# EAGLE design daq_extention_board (EAGLE 7.1.0)
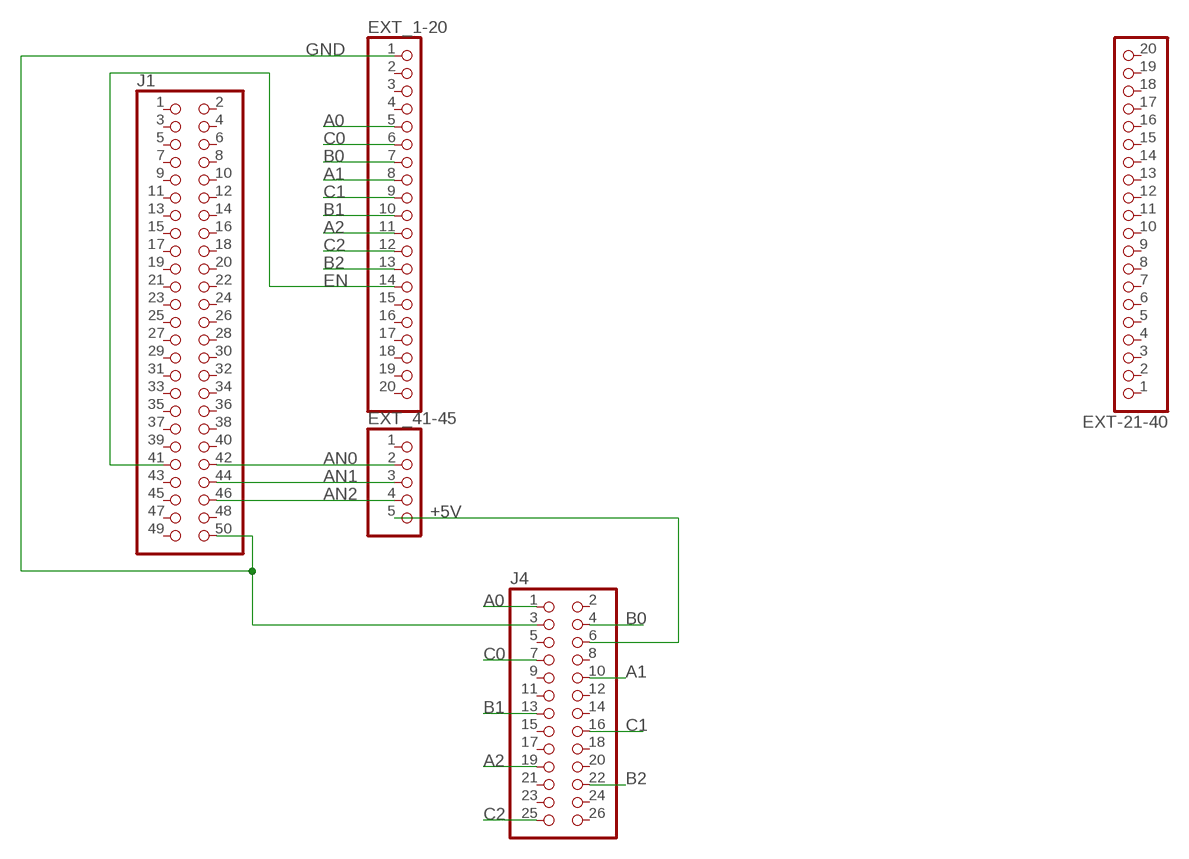
[diagram p0: schematic, sheet 1]

## Parts
EXT-21-40  PINHD-1X20  [1X20]
EXT_1-20  PINHD-1X20  [1X20]
EXT_41-45  PINHD-1X5  [1X05]
J1  PINHD-2X25  [2X25]
J4  PINHD-2X13  [2X13]

## Nets
+5V: EXT_41-45.5 J4.6
A0: EXT_1-20.5 J4.1
A1: EXT_1-20.8 J4.10
A2: EXT_1-20.11 J4.19
AN0: EXT_41-45.2 J1.42
AN1: EXT_41-45.3 J1.44
AN2: EXT_41-45.4 J1.46
B0: EXT_1-20.7 J4.4
B1: EXT_1-20.10 J4.13
B2: EXT_1-20.13 J4.22
C0: EXT_1-20.6 J4.7
C1: EXT_1-20.9 J4.16
C2: EXT_1-20.12 J4.25
EN: EXT_1-20.14 J1.41
GND: EXT_1-20.1 J1.50 J4.3
Unconnected: EXT-21-40.1 EXT-21-40.2 EXT-21-40.3 EXT-21-40.4 EXT-21-40.5 EXT-21-40.6 EXT-21-40.7 EXT-21-40.8 EXT-21-40.9 EXT-21-40.10 EXT-21-40.11 EXT-21-40.12 EXT-21-40.13 EXT-21-40.14 EXT-21-40.15 EXT-21-40.16 EXT-21-40.17 EXT-21-40.18 EXT-21-40.19 EXT-21-40.20 EXT_1-20.2 EXT_1-20.3 EXT_1-20.4 EXT_1-20.15 EXT_1-20.16 EXT_1-20.17 EXT_1-20.18 EXT_1-20.19 EXT_1-20.20 EXT_41-45.1 J1.1 J1.2 J1.3 J1.4 J1.5 J1.6 J1.7 J1.8 J1.9 J1.10 J1.11 J1.12 J1.13 J1.14 J1.15 J1.16 J1.17 J1.18 J1.19 J1.20 J1.21 J1.22 J1.23 J1.24 J1.25 J1.26 J1.27 J1.28 J1.29 J1.30 J1.31 J1.32 J1.33 J1.34 J1.35 J1.36 J1.37 J1.38 J1.39 J1.40 J1.43 J1.45 J1.47 J1.48 J1.49 J4.2 J4.5 J4.8 J4.9 J4.11 J4.12 J4.14 J4.15 J4.17 J4.18 J4.20 J4.21 J4.23 J4.24 J4.26

## Library data of the parts
EXT-21-40 EXT_1-20 = pinhead:PINHD-1X20: PIN HEADER
EXT_41-45 = pinhead:PINHD-1X5: PIN HEADER
J1 = pinhead:PINHD-2X25: PIN HEADER
J4 = pinhead:PINHD-2X13: PIN HEADER

## Board
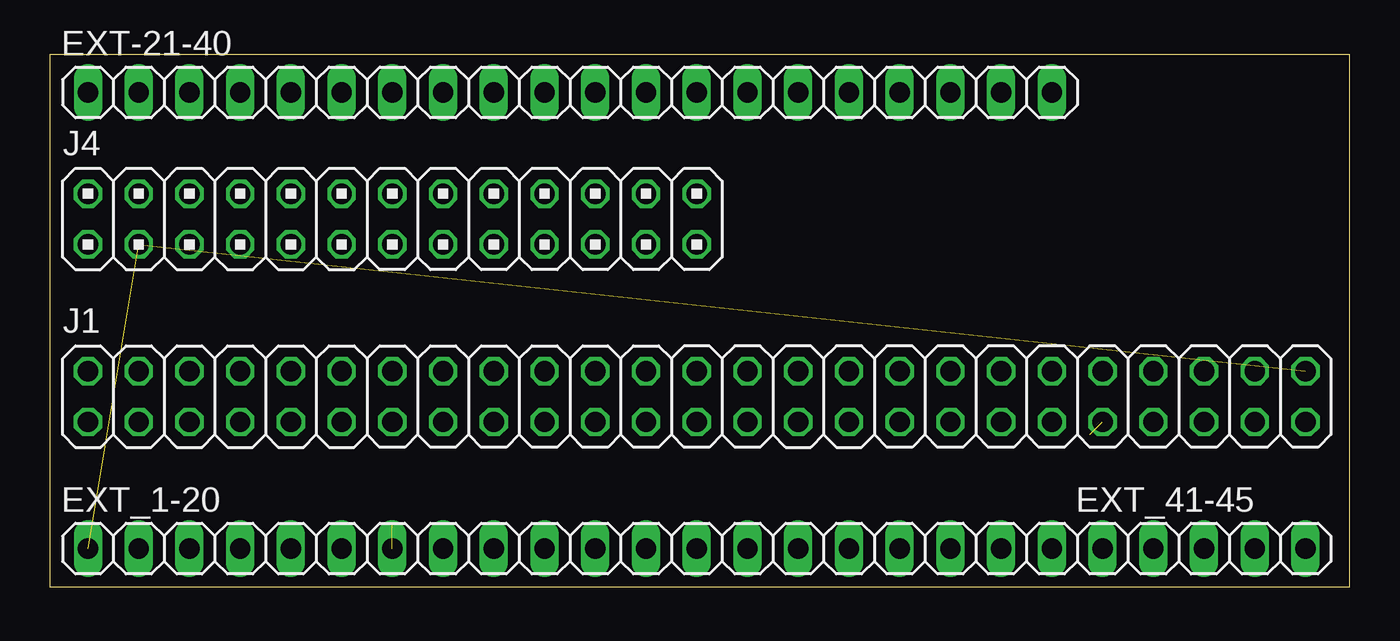
[diagram p1: board, top side]
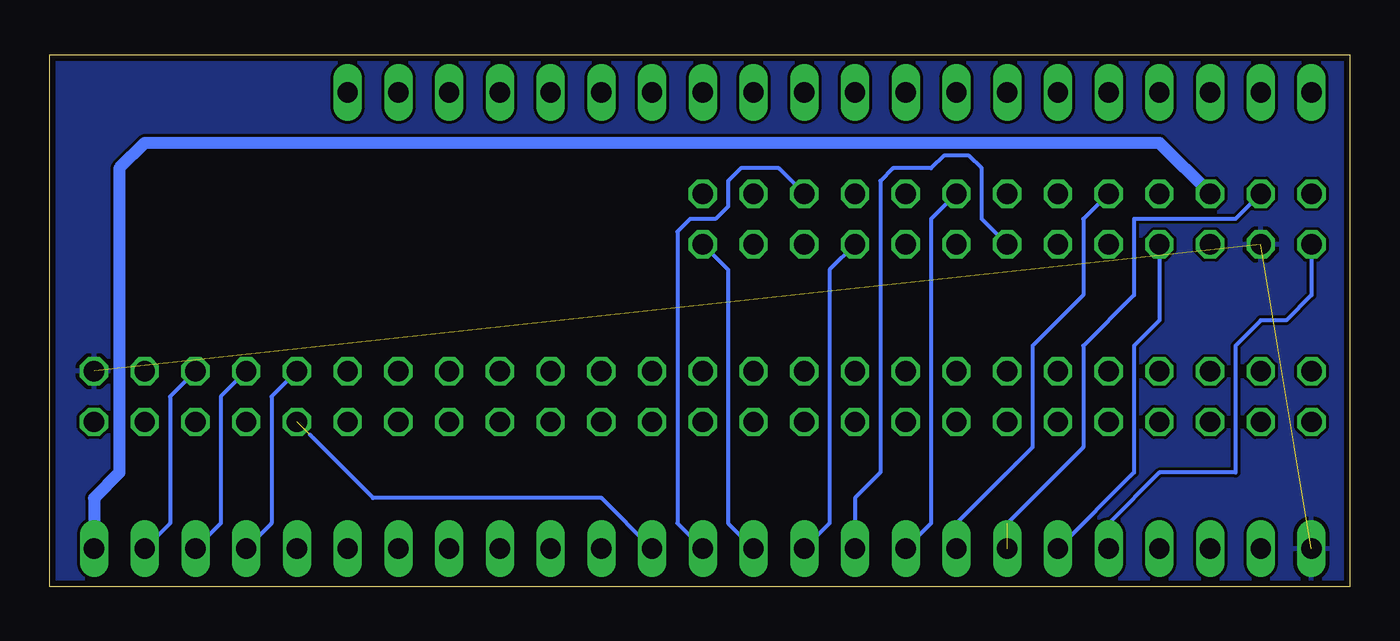
[diagram p2: board, bottom side, seen from below]

Size 65.08 x 26.66 mm. Coordinates in mm from the lower left corner, seen from the top.
Outline: 0,0 65.08,0 65.08,26.66 0,26.66 0,0
Copper layers (1*16): Top 0.035mm / dielectric 1.5mm / Bottom 0.035mm
Design rules "PCB-POOL Standard": minimum track width 0.15mm, minimum drill 0.3mm, track to track 0.15mm, track to pad 0.15mm, pad to pad 0.15mm, via to via 0.15mm, smd to smd 0.15mm, copper to edge 0.3mm, drill to drill 0.2mm, minimum pad ring 0.2mm, minimum via ring 0.15mm, stop-mask expansion 0.075mm, vias tented up to drill 0mil, thermal gap 0.2mm

### Footprints (pad centres in the part's own frame; a part is rotated, then mirrored left to right if it is on the bottom)
1X20 = drill 1.016 long: 1 -24.13,0; 2 -21.59,0; 3 -19.05,0; 4 -16.51,0; 5 -13.97,0; 6 -11.43,0; 7 -8.89,0; 8 -6.35,0; 9 -3.81,0; 10 -1.27,0; 11 1.27,0; 12 3.81,0; 13 6.35,0; 14 8.89,0; 15 11.43,0; 16 13.97,0; 17 16.51,0; 18 19.05,0; 19 21.59,0; 20 24.13,0
1X05 = drill 1.016 long: 1 -5.08,0; 2 -2.54,0; 3 0,0; 4 2.54,0; 5 5.08,0
2X25 = drill 1.016 octagon: 1 -30.48,-1.27; 2 -30.48,1.27; 3 -27.94,-1.27; 4 -27.94,1.27; 5 -25.4,-1.27; 6 -25.4,1.27; 7 -22.86,-1.27; 8 -22.86,1.27; 9 -20.32,-1.27; 10 -20.32,1.27; 11 -17.78,-1.27; 12 -17.78,1.27; 13 -15.24,-1.27; 14 -15.24,1.27; 15 -12.7,-1.27; 16 -12.7,1.27; 17 -10.16,-1.27; 18 -10.16,1.27; 19 -7.62,-1.27; 20 -7.62,1.27; 21 -5.08,-1.27; 22 -5.08,1.27; 23 -2.54,-1.27; 24 -2.54,1.27; 25 0,-1.27; 26 0,1.27; 27 2.54,-1.27; 28 2.54,1.27; 29 5.08,-1.27; 30 5.08,1.27; 31 7.62,-1.27; 32 7.62,1.27; 33 10.16,-1.27; 34 10.16,1.27; 35 12.7,-1.27; 36 12.7,1.27; 37 15.24,-1.27; 38 15.24,1.27; 39 17.78,-1.27; 40 17.78,1.27; 41 20.32,-1.27; 42 20.32,1.27; 43 22.86,-1.27; 44 22.86,1.27; 45 25.4,-1.27; 46 25.4,1.27; 47 27.94,-1.27; 48 27.94,1.27; 49 30.48,-1.27; 50 30.48,1.27
2X13 = drill 1.016 octagon: 1 -15.24,-1.27; 2 -15.24,1.27; 3 -12.7,-1.27; 4 -12.7,1.27; 5 -10.16,-1.27; 6 -10.16,1.27; 7 -7.62,-1.27; 8 -7.62,1.27; 9 -5.08,-1.27; 10 -5.08,1.27; 11 -2.54,-1.27; 12 -2.54,1.27; 13 0,-1.27; 14 0,1.27; 15 2.54,-1.27; 16 2.54,1.27; 17 5.08,-1.27; 18 5.08,1.27; 19 7.62,-1.27; 20 7.62,1.27; 21 10.16,-1.27; 22 10.16,1.27; 23 12.7,-1.27; 24 12.7,1.27; 25 15.24,-1.27; 26 15.24,1.27

### Placement (x,y rotation side)
EXT-21-40  26.04,24.77 0 top
EXT_1-20  26.04,1.91 0 top
EXT_41-45  57.78,1.91 0 top
J1  32.38,9.53 0 top
J4  17.14,18.41 0 top

### Tracks (layer width: path | path; a pad name or v marks a point on that pad's centre or on a via)
+5V
  Bottom 0.6: J4.6 9.53,22.23 60.33,22.23 61.59,20.95 61.59,5.71 62.87,4.45 EXT_41-45.5
A0
  Bottom 0.2: J4.1 1.91,14.61 3.17,13.34 4.45,13.34 5.71,12.06 5.71,5.71 9.53,5.71 12.06,3.17 EXT_1-20.5
A1
  Bottom 0.2: J4.10 13.34,18.41 13.34,14.61 15.88,12.06 15.88,6.99 19.68,3.17 EXT_1-20.8
A2
  Bottom 0.2: J4.19 26.04,15.88 26.04,3.17 EXT_1-20.11
AN0
  Bottom 0.2: J1.42 53.98,9.53 53.98,3.17 EXT_41-45.2
AN1
  Bottom 0.2: J1.44 56.52,9.53 56.52,3.17 EXT_41-45.3
AN2
  Bottom 0.2: J1.46 59.05,9.53 59.05,3.17 EXT_41-45.4
B0  (1 unrouted)
  Bottom 0.2: J4.4 5.71,18.41 10.79,18.41 10.79,14.61 13.34,12.06 13.34,6.99 17.14,3.17
B1
  Bottom 0.2: J4.13 18.41,18.41 18.41,20.95 19.05,21.59 20.32,21.59 20.95,20.95 22.86,20.95 23.5,20.32 23.5,5.71 24.77,4.45 EXT_1-20.10
B2
  Bottom 0.2: J4.22 28.57,20.95 30.48,20.95 31.11,20.32 31.11,19.05 31.75,18.41 33.02,18.41 33.66,17.78 33.66,3.17 EXT_1-20.13
C0
  Bottom 0.2: J4.7 9.53,13.34 10.79,12.06 10.79,5.71 EXT_1-20.6
C1
  Bottom 0.2: J4.16 20.95,18.41 20.95,3.17 EXT_1-20.9
C2
  Bottom 0.2: J4.25 31.11,15.88 31.11,3.17 EXT_1-20.12
EN  (1 unrouted)
  Bottom 0.2: EXT_1-20.14 37.47,4.45 48.9,4.45 52.07,7.62
GND  (2 unrouted)
  pour Bottom: -0.64,-0.64 -0.64,27.3 65.41,27.3 65.41,-0.64